# EAGLE schematic alu (EAGLE 7.5.0)
ALU

## Sheet 1 of 4: ALU CORE
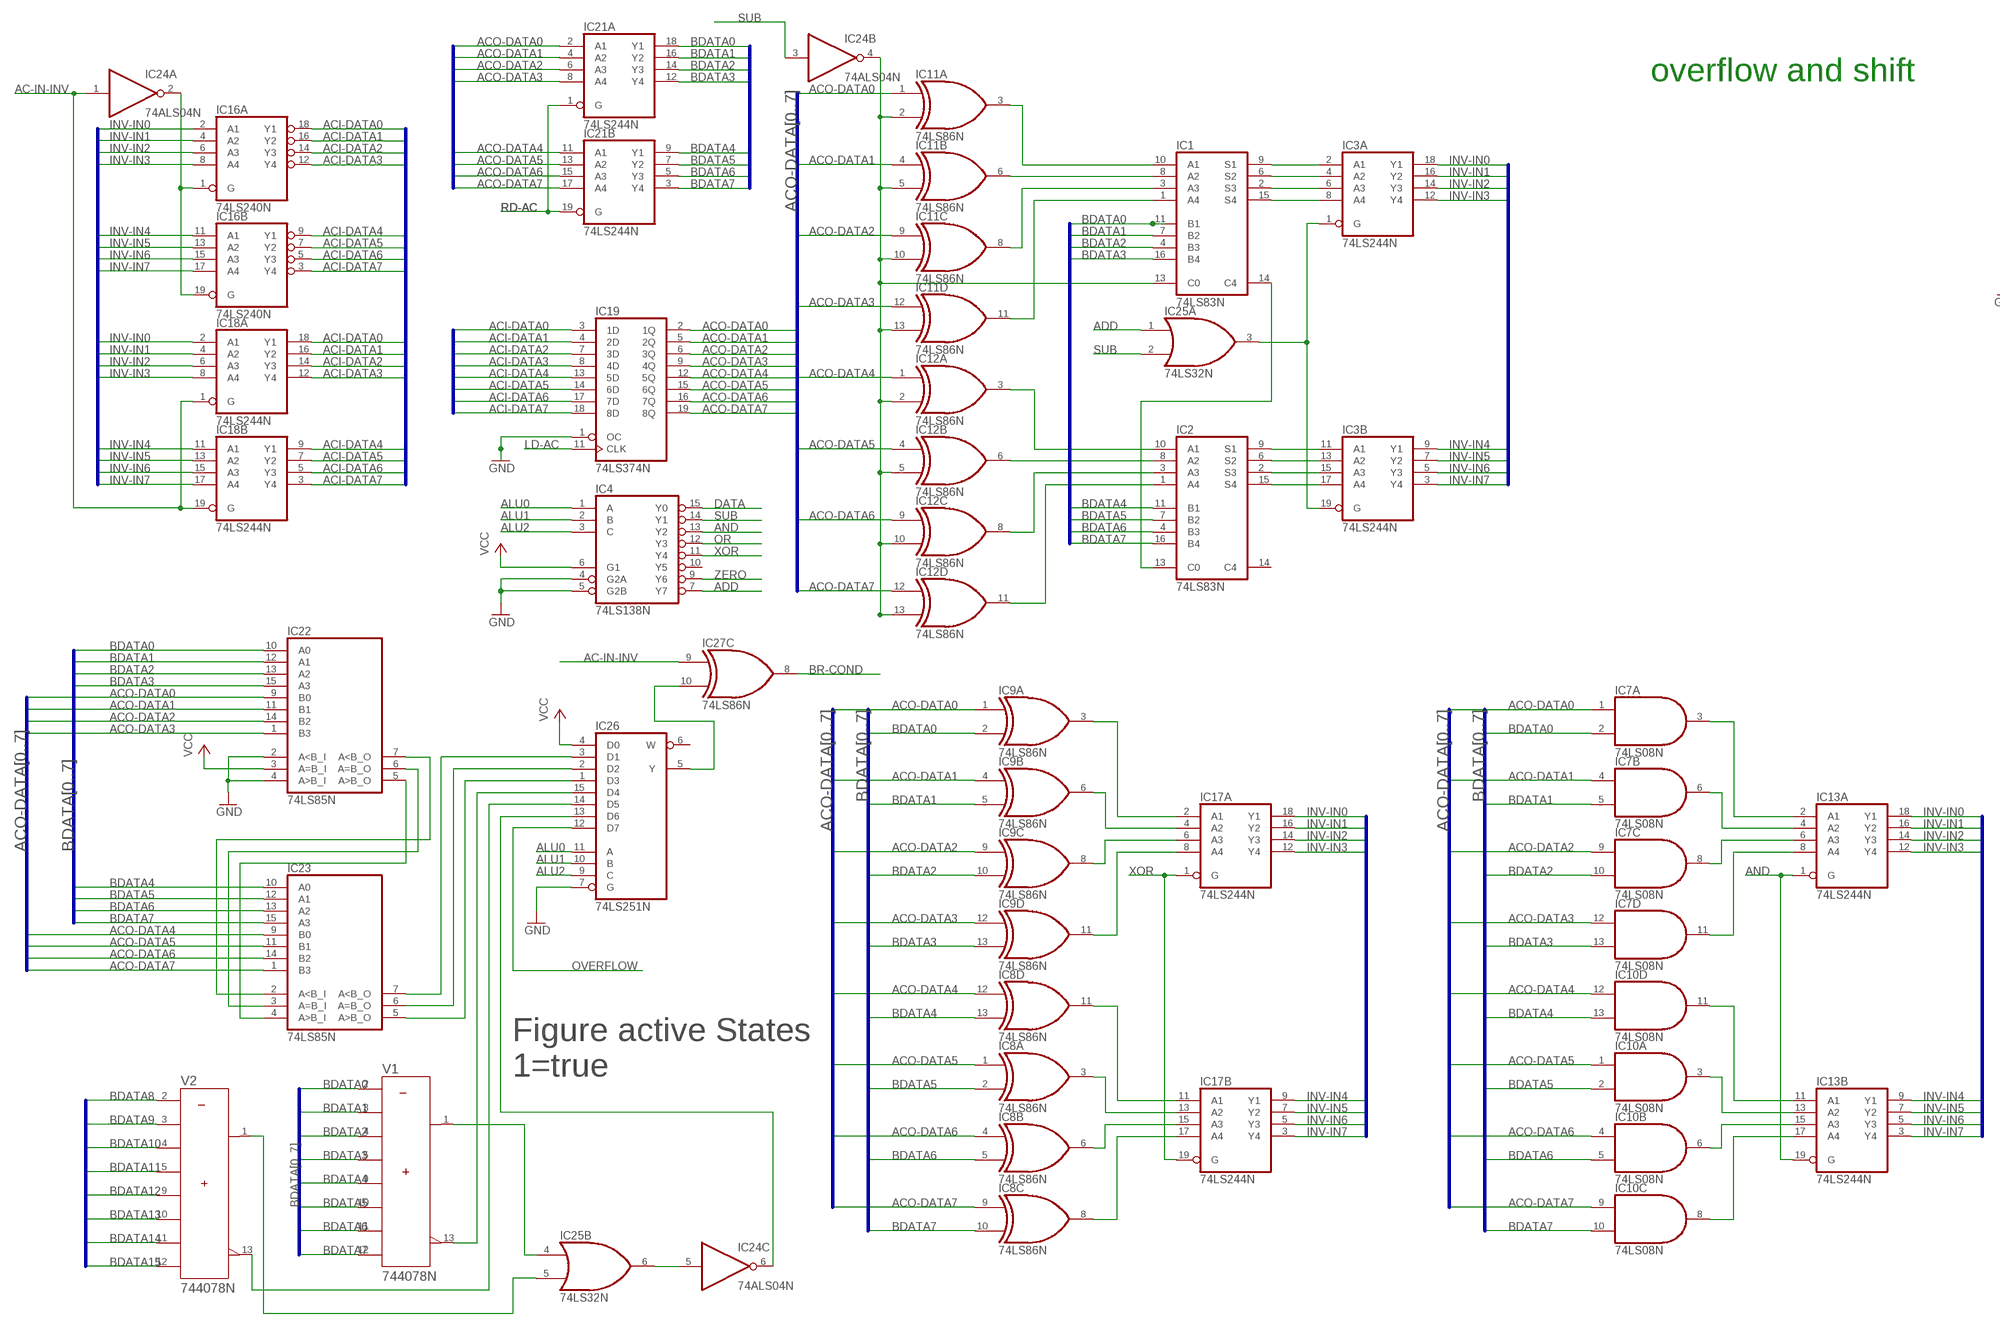
[diagram p0: schematic, sheet 1, part 1 of 2]
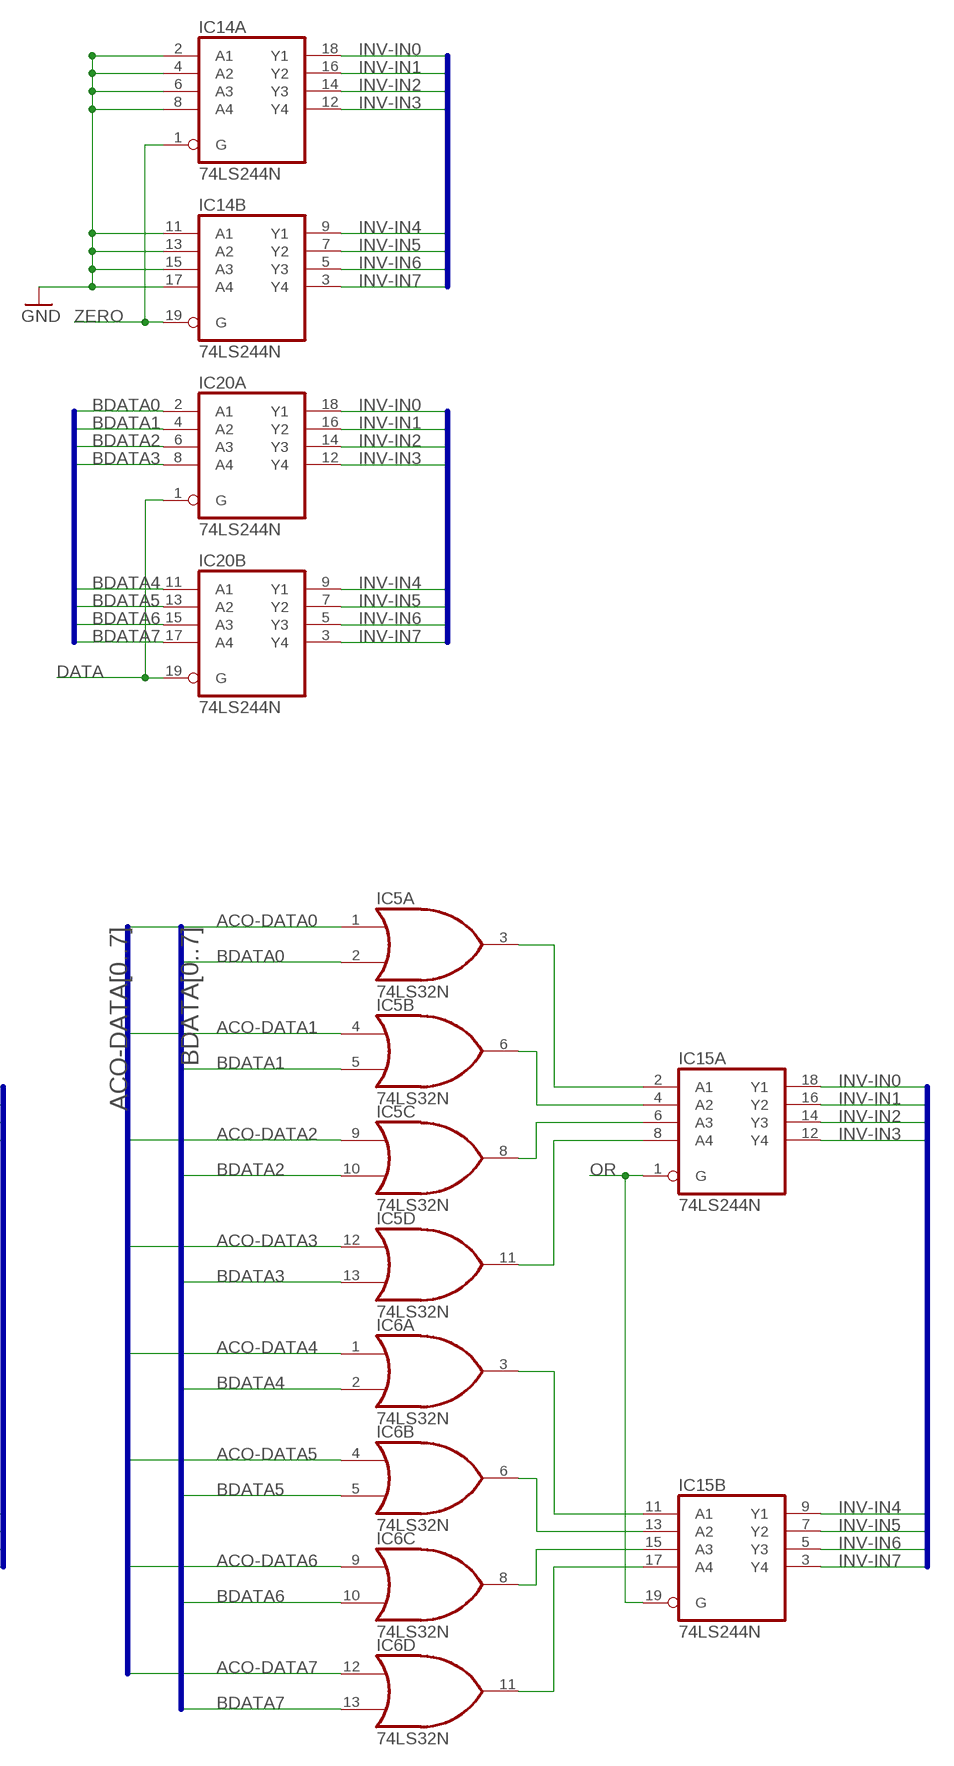
[diagram p1: schematic, sheet 1, part 2 of 2]

### Parts
IC1  74LS83N  [DIL16]
IC2  74LS83N  [DIL16]
IC3  74LS244N  [DIL20]
IC4  74LS138N  [DIL16]
IC5  74LS32N  [DIL14]
IC6  74LS32N  [DIL14]
IC7  74LS08N  [DIL14]
IC8  74LS86N  [DIL14]
IC9  74LS86N  [DIL14]
IC10  74LS08N  [DIL14]
IC11  74LS86N  [DIL14]
IC12  74LS86N  [DIL14]
IC13  74LS244N  [DIL20]
IC14  74LS244N  [DIL20]
IC15  74LS244N  [DIL20]
IC16  74LS240N  [DIL20]
IC17  74LS244N  [DIL20]
IC18  74LS244N  [DIL20]
IC19  74LS374N  [DIL20]
IC20  74LS244N  [DIL20]
IC21  74LS244N  [DIL20]
IC22  74LS85N  [DIL16]
IC23  74LS85N  [DIL16]
IC24  74ALS04N  [DIL14]
IC25  74LS32N  [DIL14]
IC26  74LS251N  [DIL16]
IC27  74LS86N  [DIL14]
V1  744078N  [DIL14]
V2  744078N  [DIL14]

### Nets
-SUB: IC1.13(C0) IC11.2(A:I1) IC11.5(B:I1) IC11.10(C:I1) IC11.13(D:I1) IC12.2(A:I1) IC12.5(B:I1) IC12.10(C:I1) IC12.13(D:I1) IC24.4(B:O)
AC-IN-INV: IC18.1(A:G) IC18.19(B:G) IC24.1(A:I) IC27.9(C:I0) ; also sheet 2
ACI-DATA0: IC16.18(A:Y1) IC18.18(A:Y1) IC19.3(1D)
ACI-DATA1: IC16.16(A:Y2) IC18.16(A:Y2) IC19.4(2D)
ACI-DATA2: IC16.14(A:Y3) IC18.14(A:Y3) IC19.7(3D)
ACI-DATA3: IC16.12(A:Y4) IC18.12(A:Y4) IC19.8(4D)
ACI-DATA4: IC16.9(B:Y1) IC18.9(B:Y1) IC19.13(5D)
ACI-DATA5: IC16.7(B:Y2) IC18.7(B:Y2) IC19.14(6D)
ACI-DATA6: IC16.5(B:Y3) IC18.5(B:Y3) IC19.17(7D)
ACI-DATA7: IC16.3(B:Y4) IC18.3(B:Y4) IC19.18(8D)
ACO-DATA0: IC5.1(A:I0) IC7.1(A:I0) IC9.1(A:I0) IC11.1(A:I0) IC19.2(1Q) IC21.2(A:A1) IC22.9(B0)
ACO-DATA1: IC5.4(B:I0) IC7.4(B:I0) IC9.4(B:I0) IC11.4(B:I0) IC19.5(2Q) IC21.4(A:A2) IC22.11(B1)
ACO-DATA2: IC5.9(C:I0) IC7.9(C:I0) IC9.9(C:I0) IC11.9(C:I0) IC19.6(3Q) IC21.6(A:A3) IC22.14(B2)
ACO-DATA3: IC5.12(D:I0) IC7.12(D:I0) IC9.12(D:I0) IC11.12(D:I0) IC19.9(4Q) IC21.8(A:A4) IC22.1(B3)
ACO-DATA4: IC6.1(A:I0) IC8.12(D:I0) IC10.12(D:I0) IC12.1(A:I0) IC19.12(5Q) IC21.11(B:A1) IC23.9(B0)
ACO-DATA5: IC6.4(B:I0) IC8.1(A:I0) IC10.1(A:I0) IC12.4(B:I0) IC19.15(6Q) IC21.13(B:A2) IC23.11(B1)
ACO-DATA6: IC6.9(C:I0) IC8.4(B:I0) IC10.4(B:I0) IC12.9(C:I0) IC19.16(7Q) IC21.15(B:A3) IC23.14(B2)
ACO-DATA7: IC6.12(D:I0) IC8.9(C:I0) IC10.9(C:I0) IC12.12(D:I0) IC19.19(8Q) IC21.17(B:A4) IC23.1(B3)
ADD: IC4.7(Y7) IC25.1(A:I0)
ALU0: IC4.1(A) IC26.11(A) ; also sheet 2
ALU1: IC4.2(B) IC26.10(B) ; also sheet 2
ALU2: IC4.3(C) IC26.9(C) ; also sheet 2
AND: IC4.13(Y2) IC13.1(A:G) IC13.19(B:G)
BDATA0: IC1.11(B1) IC5.2(A:I1) IC7.2(A:I1) IC9.2(A:I1) IC20.2(A:A1) IC21.18(A:Y1) IC22.10(A0) V1.2(A) ; also sheet 3
BDATA1: IC1.7(B2) IC5.5(B:I1) IC7.5(B:I1) IC9.5(B:I1) IC20.4(A:A2) IC21.16(A:Y2) IC22.12(A1) V1.3(B) ; also sheet 3
BDATA2: IC1.4(B3) IC5.10(C:I1) IC7.10(C:I1) IC9.10(C:I1) IC20.6(A:A3) IC21.14(A:Y3) IC22.13(A2) V1.4(C) ; also sheet 3
BDATA3: IC1.16(B4) IC5.13(D:I1) IC7.13(D:I1) IC9.13(D:I1) IC20.8(A:A4) IC21.12(A:Y4) IC22.15(A3) V1.5(D) ; also sheet 3
BDATA4: IC2.11(B1) IC6.2(A:I1) IC8.13(D:I1) IC10.13(D:I1) IC20.11(B:A1) IC21.9(B:Y1) IC23.10(A0) V1.9(E) ; also sheet 3
BDATA5: IC2.7(B2) IC6.5(B:I1) IC8.2(A:I1) IC10.2(A:I1) IC20.13(B:A2) IC21.7(B:Y2) IC23.12(A1) V1.10(F) ; also sheet 3
BDATA6: IC2.4(B3) IC6.10(C:I1) IC8.5(B:I1) IC10.5(B:I1) IC20.15(B:A3) IC21.5(B:Y3) IC23.13(A2) V1.11(G) ; also sheet 3
BDATA7: IC2.16(B4) IC6.13(D:I1) IC8.10(C:I1) IC10.10(C:I1) IC20.17(B:A4) IC21.3(B:Y4) IC23.15(A3) V1.12(H) ; also sheet 3
BDATA8: V2.2(A) ; also sheet 3
BDATA9: V2.3(B) ; also sheet 3
BDATA10: V2.4(C) ; also sheet 3
BDATA11: V2.5(D) ; also sheet 3
BDATA12: V2.9(E) ; also sheet 3
BDATA13: V2.10(F) ; also sheet 3
BDATA14: V2.11(G) ; also sheet 3
BDATA15: V2.12(H) ; also sheet 3
BR-COND: IC27.8(C:O) ; also sheet 2
DATA: IC4.15(Y0) IC20.1(A:G) IC20.19(B:G)
GND: IC4.4(G2A) IC4.5(G2B) IC14.2(A:A1) IC14.4(A:A2) IC14.6(A:A3) IC14.8(A:A4) IC14.11(B:A1) IC14.13(B:A2) IC14.15(B:A3) IC14.17(B:A4) IC19.1(OC) IC22.2(A<B_I) IC22.4(A>B_I) IC26.7(G) ; also sheet 2
INV-IN0: IC3.18(A:Y1) IC13.18(A:Y1) IC14.18(A:Y1) IC15.18(A:Y1) IC16.2(A:A1) IC17.18(A:Y1) IC18.2(A:A1) IC20.18(A:Y1)
INV-IN1: IC3.16(A:Y2) IC13.16(A:Y2) IC14.16(A:Y2) IC15.16(A:Y2) IC16.4(A:A2) IC17.16(A:Y2) IC18.4(A:A2) IC20.16(A:Y2)
INV-IN2: IC3.14(A:Y3) IC13.14(A:Y3) IC14.14(A:Y3) IC15.14(A:Y3) IC16.6(A:A3) IC17.14(A:Y3) IC18.6(A:A3) IC20.14(A:Y3)
INV-IN3: IC3.12(A:Y4) IC13.12(A:Y4) IC14.12(A:Y4) IC15.12(A:Y4) IC16.8(A:A4) IC17.12(A:Y4) IC18.8(A:A4) IC20.12(A:Y4)
INV-IN4: IC3.9(B:Y1) IC13.9(B:Y1) IC14.9(B:Y1) IC15.9(B:Y1) IC16.11(B:A1) IC17.9(B:Y1) IC18.11(B:A1) IC20.9(B:Y1)
INV-IN5: IC3.7(B:Y2) IC13.7(B:Y2) IC14.7(B:Y2) IC15.7(B:Y2) IC16.13(B:A2) IC17.7(B:Y2) IC18.13(B:A2) IC20.7(B:Y2)
INV-IN6: IC3.5(B:Y3) IC13.5(B:Y3) IC14.5(B:Y3) IC15.5(B:Y3) IC16.15(B:A3) IC17.5(B:Y3) IC18.15(B:A3) IC20.5(B:Y3)
INV-IN7: IC3.3(B:Y4) IC13.3(B:Y4) IC14.3(B:Y4) IC15.3(B:Y4) IC16.17(B:A4) IC17.3(B:Y4) IC18.17(B:A4) IC20.3(B:Y4)
LD-AC: IC19.11(CLK) ; also sheet 2
N$1: IC5.3(A:O) IC15.2(A:A1)
N$2: IC5.6(B:O) IC15.4(A:A2)
N$3: IC5.8(C:O) IC15.6(A:A3)
N$4: IC5.11(D:O) IC15.8(A:A4)
N$5: IC6.3(A:O) IC15.11(B:A1)
N$6: IC6.6(B:O) IC15.13(B:A2)
N$7: IC6.8(C:O) IC15.15(B:A3)
N$8: IC6.11(D:O) IC15.17(B:A4)
N$9: IC7.3(A:O) IC13.2(A:A1)
N$10: IC7.6(B:O) IC13.4(A:A2)
N$11: IC7.8(C:O) IC13.6(A:A3)
N$12: IC7.11(D:O) IC13.8(A:A4)
N$13: IC10.11(D:O) IC13.11(B:A1)
N$14: IC10.3(A:O) IC13.13(B:A2)
N$15: IC10.6(B:O) IC13.15(B:A3)
N$16: IC10.8(C:O) IC13.17(B:A4)
N$17: IC9.3(A:O) IC17.2(A:A1)
N$18: IC9.6(B:O) IC17.4(A:A2)
N$19: IC9.8(C:O) IC17.6(A:A3)
N$20: IC9.11(D:O) IC17.8(A:A4)
N$21: IC8.11(D:O) IC17.11(B:A1)
N$22: IC8.3(A:O) IC17.13(B:A2)
N$23: IC8.6(B:O) IC17.15(B:A3)
N$24: IC8.8(C:O) IC17.17(B:A4)
N$25: IC1.8(A2) IC11.6(B:O)
N$26: IC1.3(A3) IC11.8(C:O)
N$27: IC1.1(A4) IC11.11(D:O)
N$28: IC1.10(A1) IC11.3(A:O)
N$29: IC2.10(A1) IC12.3(A:O)
N$30: IC2.8(A2) IC12.6(B:O)
N$31: IC2.3(A3) IC12.8(C:O)
N$32: IC2.1(A4) IC12.11(D:O)
N$33: IC1.9(S1) IC3.2(A:A1)
N$34: IC1.6(S2) IC3.4(A:A2)
N$35: IC1.2(S3) IC3.6(A:A3)
N$36: IC1.15(S4) IC3.8(A:A4)
N$37: IC2.9(S1) IC3.11(B:A1)
N$38: IC2.6(S2) IC3.13(B:A2)
N$39: IC2.2(S3) IC3.15(B:A3)
N$40: IC2.15(S4) IC3.17(B:A4)
N$41: IC1.14(C4) IC2.13(C0)
N$42: IC16.1(A:G) IC16.19(B:G) IC24.2(A:O)
N$43: IC22.5(A>B_O) IC23.4(A>B_I)
N$44: IC3.1(A:G) IC3.19(B:G) IC25.3(A:O)
N$45: IC22.6(A=B_O) IC23.3(A=B_I)
N$46: IC22.7(A<B_O) IC23.2(A<B_I)
N$47: IC23.7(A<B_O) IC26.3(D1)
N$48: IC23.6(A=B_O) IC26.2(D2)
N$49: IC23.5(A>B_O) IC26.1(D3)
N$50: IC25.4(B:I0) V1.1(Y)
N$51: IC26.15(D4) V1.13(W)
N$52: IC26.14(D5) V2.13(W)
N$53: IC25.5(B:I1) V2.1(Y)
N$54: IC24.5(C:I) IC25.6(B:O)
N$55: IC24.6(C:O) IC26.13(D6)
N$56: IC26.5(Y) IC27.10(C:I1)
OR: IC4.12(Y3) IC15.1(A:G) IC15.19(B:G)
OVERFLOW: IC26.12(D7)
RD-AC: IC21.1(A:G) IC21.19(B:G) ; also sheet 2
SUB: IC4.14(Y1) IC24.3(B:I) IC25.2(A:I1)
VCC: IC4.6(G1) IC22.3(A=B_I) IC26.4(D0) ; also sheet 2
XOR: IC4.11(Y4) IC17.1(A:G) IC17.19(B:G)
ZERO: IC4.9(Y6) IC14.1(A:G) IC14.19(B:G)
Unconnected: IC2.14(C4) IC4.10(Y5) IC24.8(D:O) IC24.9(D:I) IC24.10(E:O) IC24.11(E:I) IC24.12(F:O) IC24.13(F:I) IC25.8(C:O) IC25.9(C:I0) IC25.10(C:I1) IC25.11(D:O) IC25.12(D:I0) IC25.13(D:I1) IC26.6(W) IC27.1(A:I0) IC27.2(A:I1) IC27.3(A:O) IC27.4(B:I0) IC27.5(B:I1) IC27.6(B:O) IC27.11(D:O) IC27.12(D:I0) IC27.13(D:I1)

### Buses
INV-IN[0..7]
ACO-DATA[0..7]
BDATA[0..7]
ACI-DATA[0..7]
BDATA[8..15]

### Notes on the sheet
- overflow and shift
- Figure active States
  1=true

## Sheet 2 of 4: BUS
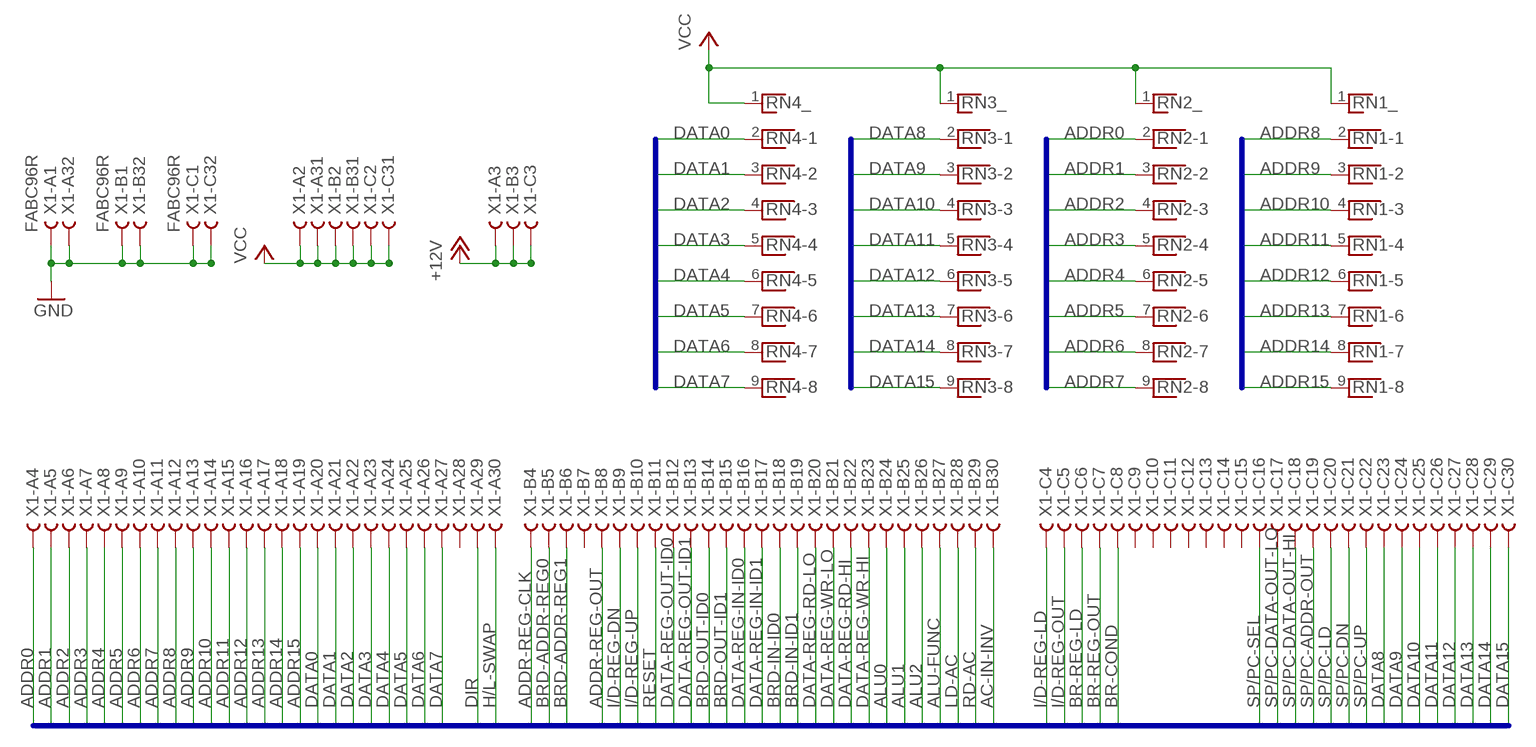
[diagram p2: schematic, sheet 2]

### Parts
RN1  RNX8  [RN-9]
RN2  RNX8  [RN-9]
RN3  RNX8  [RN-9]
RN4  RNX8  [RN-9]
X1  FABC96R  [FABC96R]

### Nets
+12V: X1.A3 X1.B3 X1.C3
AC-IN-INV: X1.B30 ; also sheet 1
ADDR0: RN2.2 X1.A4
ADDR1: RN2.3 X1.A5
ADDR2: RN2.4 X1.A6
ADDR3: RN2.5 X1.A7
ADDR4: RN2.6 X1.A8
ADDR5: RN2.7 X1.A9
ADDR6: RN2.8 X1.A10
ADDR7: RN2.9 X1.A11
ADDR8: RN1.2 X1.A12
ADDR9: RN1.3 X1.A13
ADDR10: RN1.4 X1.A14
ADDR11: RN1.5 X1.A15
ADDR12: RN1.6 X1.A16
ADDR13: RN1.7 X1.A17
ADDR14: RN1.8 X1.A18
ADDR15: RN1.9 X1.A19
ADDR-REG-CLK: X1.B4
ADDR-REG-OUT: X1.B8
ALU0: X1.B24 ; also sheet 1
ALU1: X1.B25 ; also sheet 1
ALU2: X1.B26 ; also sheet 1
ALU-FUNC: X1.B27
BR-COND: X1.C8 ; also sheet 1
BR-REG-LD: X1.C6
BR-REG-OUT: X1.C7
BRD-ADDR-REG0: X1.B5
BRD-ADDR-REG1: X1.B6
BRD-IN-ID0: X1.B18
BRD-IN-ID1: X1.B19
BRD-OUT-ID0: X1.B14
BRD-OUT-ID1: X1.B15
DATA0: RN4.2 X1.A20
DATA1: RN4.3 X1.A21
DATA2: RN4.4 X1.A22
DATA3: RN4.5 X1.A23
DATA4: RN4.6 X1.A24
DATA5: RN4.7 X1.A25
DATA6: RN4.8 X1.A26
DATA7: RN4.9 X1.A27
DATA8: RN3.2 X1.C23
DATA9: RN3.3 X1.C24
DATA10: RN3.4 X1.C25
DATA11: RN3.5 X1.C26
DATA12: RN3.6 X1.C27
DATA13: RN3.7 X1.C28
DATA14: RN3.8 X1.C29
DATA15: RN3.9 X1.C30
DATA-REG-IN-ID0: X1.B16
DATA-REG-IN-ID1: X1.B17
DATA-REG-OUT-ID0: X1.B12
DATA-REG-OUT-ID1: X1.B13
DATA-REG-RD-HI: X1.B22
DATA-REG-RD-LO: X1.B20
DATA-REG-WR-HI: X1.B23
DATA-REG-WR-LO: X1.B21
DIR: X1.A29
GND: X1.A1 X1.A32 X1.B1 X1.B32 X1.C1 X1.C32 ; also sheet 1
H/L-SWAP: X1.A30
I/D-REG-DN: X1.B9 ; also sheet 3
I/D-REG-LD: X1.C4 ; also sheet 3
I/D-REG-OUT: X1.C5 ; also sheet 3
I/D-REG-UP: X1.B10 ; also sheet 3
LD-AC: X1.B28 ; also sheet 1
RD-AC: X1.B29 ; also sheet 1
RESET: X1.B11 ; also sheet 3
SP/PC-ADDR-OUT: X1.C19
SP/PC-DATA-OUT-HI: X1.C18
SP/PC-DATA-OUT-LO: X1.C17
SP/PC-DN: X1.C21
SP/PC-LD: X1.C20
SP/PC-SEL: X1.C16
SP/PC-UP: X1.C22
VCC: RN1.1 RN2.1 RN3.1 RN4.1 X1.A2 X1.A31 X1.B2 X1.B31 X1.C2 X1.C31 ; also sheet 1
Unconnected: X1.A28 X1.B7 X1.C9 X1.C10 X1.C11 X1.C12 X1.C13 X1.C14 X1.C15

### Buses
ADDR[0..15],DATA[0..15],DIR,H/L-SWAP,ADDR-REG-CLK,BRD-ADDR-REG[0..1],ADDR-REG-OUT,I/D-REG-DN,I/D-REG-UP,RESET,DATA-REG-OUT-ID[0..1],BRD-OUT-ID[0..1],DATA-REG-IN-ID[0..1],BRD-IN-ID[0..1],DATA-REG-RD-LO,DATA-REG-WR-LO,DATA-REG-RD-HI,DATA-REG-WR-HI,ALU[0..2],ALU-FUNC,LD-AC,RD-AC,AC-IN-INV,I/D-REG-LD,I/D-REG-OUT,BR-REG-LD,BR-REG-OUT,BR-COND,SP/PC-SEL,SP/PC-DATA-OUT-LO,SP/PC-DATA-OUT-HI,SP/PC-ADDR-OUT,SP/PC-LD,SP/PC-DN,SP/PC-UP

## Sheet 3 of 4: Reg INC/DEC
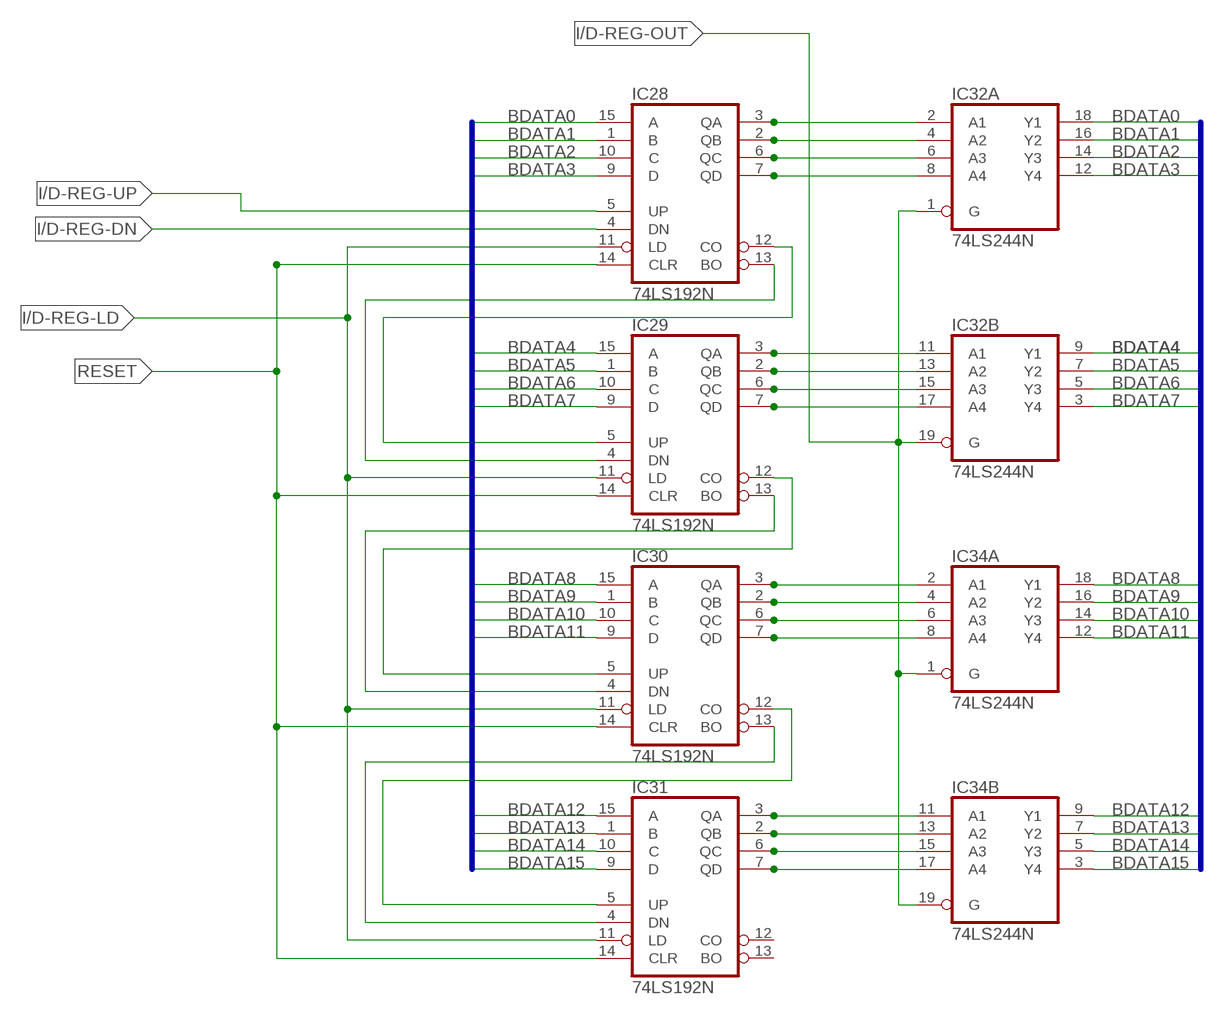
[diagram p3: schematic, sheet 3]

### Parts
IC28  74LS192N  [DIL16]
IC29  74LS192N  [DIL16]
IC30  74LS192N  [DIL16]
IC31  74LS192N  [DIL16]
IC32  74LS244N  [DIL20]
IC34  74LS244N  [DIL20]

### Nets
BDATA0: IC28.15(A) IC32.18(A:Y1) ; also sheet 1
BDATA1: IC28.1(B) IC32.16(A:Y2) ; also sheet 1
BDATA2: IC28.10(C) IC32.14(A:Y3) ; also sheet 1
BDATA3: IC28.9(D) IC32.12(A:Y4) ; also sheet 1
BDATA4: IC29.15(A) IC32.9(B:Y1) ; also sheet 1
BDATA5: IC29.1(B) IC32.7(B:Y2) ; also sheet 1
BDATA6: IC29.10(C) IC32.5(B:Y3) ; also sheet 1
BDATA7: IC29.9(D) IC32.3(B:Y4) ; also sheet 1
BDATA8: IC30.15(A) IC34.18(A:Y1) ; also sheet 1
BDATA9: IC30.1(B) IC34.16(A:Y2) ; also sheet 1
BDATA10: IC30.10(C) IC34.14(A:Y3) ; also sheet 1
BDATA11: IC30.9(D) IC34.12(A:Y4) ; also sheet 1
BDATA12: IC31.15(A) IC34.9(B:Y1) ; also sheet 1
BDATA13: IC31.1(B) IC34.7(B:Y2) ; also sheet 1
BDATA14: IC31.10(C) IC34.5(B:Y3) ; also sheet 1
BDATA15: IC31.9(D) IC34.3(B:Y4) ; also sheet 1
I/D-REG-DN: IC28.4(DN) ; also sheet 2
I/D-REG-LD: IC28.11(LD) IC29.11(LD) IC30.11(LD) IC31.11(LD) ; also sheet 2
I/D-REG-OUT: IC32.1(A:G) IC32.19(B:G) IC34.1(A:G) IC34.19(B:G) ; also sheet 2
I/D-REG-UP: IC28.5(UP) ; also sheet 2
N$58: IC28.13(BO) IC29.4(DN)
N$59: IC28.12(CO) IC29.5(UP)
N$60: IC29.13(BO) IC30.4(DN)
N$61: IC29.12(CO) IC30.5(UP)
N$62: IC30.13(BO) IC31.4(DN)
N$63: IC30.12(CO) IC31.5(UP)
R1D0: IC28.7(QD) IC32.8(A:A4)
R1D1: IC28.6(QC) IC32.6(A:A3)
R1D2: IC28.2(QB) IC32.4(A:A2)
R1D3: IC28.3(QA) IC32.2(A:A1)
R1D4: IC29.7(QD) IC32.17(B:A4)
R1D5: IC29.6(QC) IC32.15(B:A3)
R1D6: IC29.2(QB) IC32.13(B:A2)
R1D7: IC29.3(QA) IC32.11(B:A1)
R1D8: IC30.7(QD) IC34.8(A:A4)
R1D9: IC30.6(QC) IC34.6(A:A3)
R1D10: IC30.2(QB) IC34.4(A:A2)
R1D11: IC30.3(QA) IC34.2(A:A1)
R1D12: IC31.7(QD) IC34.17(B:A4)
R1D13A: IC31.6(QC) IC34.15(B:A3)
R1D14: IC31.2(QB) IC34.13(B:A2)
R1D15: IC31.3(QA) IC34.11(B:A1)
RESET: IC28.14(CLR) IC29.14(CLR) IC30.14(CLR) IC31.14(CLR) ; also sheet 2
Unconnected: IC31.12(CO) IC31.13(BO)

### Buses
BDATA[0..15]

## Sheet 4 of 4: Bus Buffering

## Power pins joined to a net without a drawn wire
+UB: V1.14(+UB) V2.14(+UB)
-UB: V1.7(-UB) V2.7(-UB)
GND: IC1.12(GND) IC2.12(GND) IC3.10(P:GND) IC4.8(GND) IC5.7(P:GND) IC6.7(P:GND) IC7.7(P:GND) IC8.7(P:GND) IC9.7(P:GND) IC10.7(P:GND) IC11.7(P:GND) IC12.7(P:GND) IC13.10(P:GND) IC14.10(P:GND) IC15.10(P:GND) IC16.10(P:GND) IC17.10(P:GND) IC18.10(P:GND) IC19.10(GND) IC20.10(P:GND) IC21.10(P:GND) IC22.8(GND) IC23.8(GND) IC24.7(P:GND) IC25.7(P:GND) IC26.8(GND) IC27.7(P:GND) IC28.8(GND) IC29.8(GND) IC30.8(GND) IC31.8(GND) IC32.10(P:GND) IC34.10(P:GND)
VCC: IC1.5(VCC) IC2.5(VCC) IC3.20(P:VCC) IC4.16(VCC) IC5.14(P:VCC) IC6.14(P:VCC) IC7.14(P:VCC) IC8.14(P:VCC) IC9.14(P:VCC) IC10.14(P:VCC) IC11.14(P:VCC) IC12.14(P:VCC) IC13.20(P:VCC) IC14.20(P:VCC) IC15.20(P:VCC) IC16.20(P:VCC) IC17.20(P:VCC) IC18.20(P:VCC) IC19.20(VCC) IC20.20(P:VCC) IC21.20(P:VCC) IC22.16(VCC) IC23.16(VCC) IC24.14(P:VCC) IC25.14(P:VCC) IC26.16(VCC) IC27.14(P:VCC) IC28.16(VCC) IC29.16(VCC) IC30.16(VCC) IC31.16(VCC) IC32.20(P:VCC) IC34.20(P:VCC)

## Library data of the parts
IC1 IC2 = 74xx-us:74*83: 4-bit binary full ADDER, fast carry
IC3 IC13-IC15 IC17 IC18 IC20 IC21 IC32 IC34 = 74xx-us:74*244: Octal BUFFER and LINE DRIVER, 3-state
IC4 = 74xx-us:74*138: 3-line to 8-line DECODER/DEMULTIPLEXER
IC5 IC6 IC25 = 74xx-us:74*32: Quad 2-input OR gate
IC7 IC10 = 74xx-us:74*08: Quad 2-input AND gate
IC8 IC9 IC11 IC12 IC27 = 74xx-us:74*86: Quad 2-input EXCLUSIV-OR (XOR) gate
IC16 = 74xx-us:74*240: Octal BUFFER and LINE DRIVER, 3-state
IC19 = 74xx-us:74*374: Octal D type transparent LATCH, edge triggered
IC22 IC23 = 74xx-us:74*85: 4-bit magnitude COMPARATOR
IC24 = 74xx-us:74*04: Hex INVERTER
IC26 = 74xx-us:74*251: 1 of 8 data SELECTOR/MULTIPLEXER, 3-state
IC28-IC31 = 74xx-us:74*192: Synchronous 4-bit UP/DOWN COUNTER
RN1-RN4 = resistor-net:RNX8: RESISTOR NETWORK; OC_FARNELL: unknown; OC_NEWARK: unknown
V1 V2 = 74ttl-din:74*4078: 8-input OR/NOR, complementary outputs
X1 = con-vg:FABC96R: CONNECTOR female, 96 pins, type R, rows ABC, grid 2.54 mm